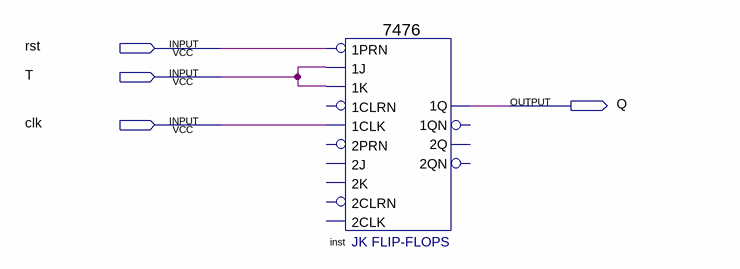
[diagram p0: schematic sheet]
// Quartus schematic TFlipFlop.bdf as structural Verilog: 1 symbols, 4 pins
module TFlipFlop (
  input  rst,
  input  T,
  input  clk,
  output Q
);

  \7476  inst (
    .\1J (T), .\1K (T), .\1PRN (rst), .\1CLK (clk), .\1Q (Q));  // open: 2PRN, 2J, 1CLRN, 2K, 2CLRN, 2CLK, 2QN, 2Q, 1QN
endmodule
